# Altium schematic sheet [2]Driver1.SchDoc: Driver 1
size A4; DocumentNumber: 2; SheetNumber: 1; SheetTotal: 1
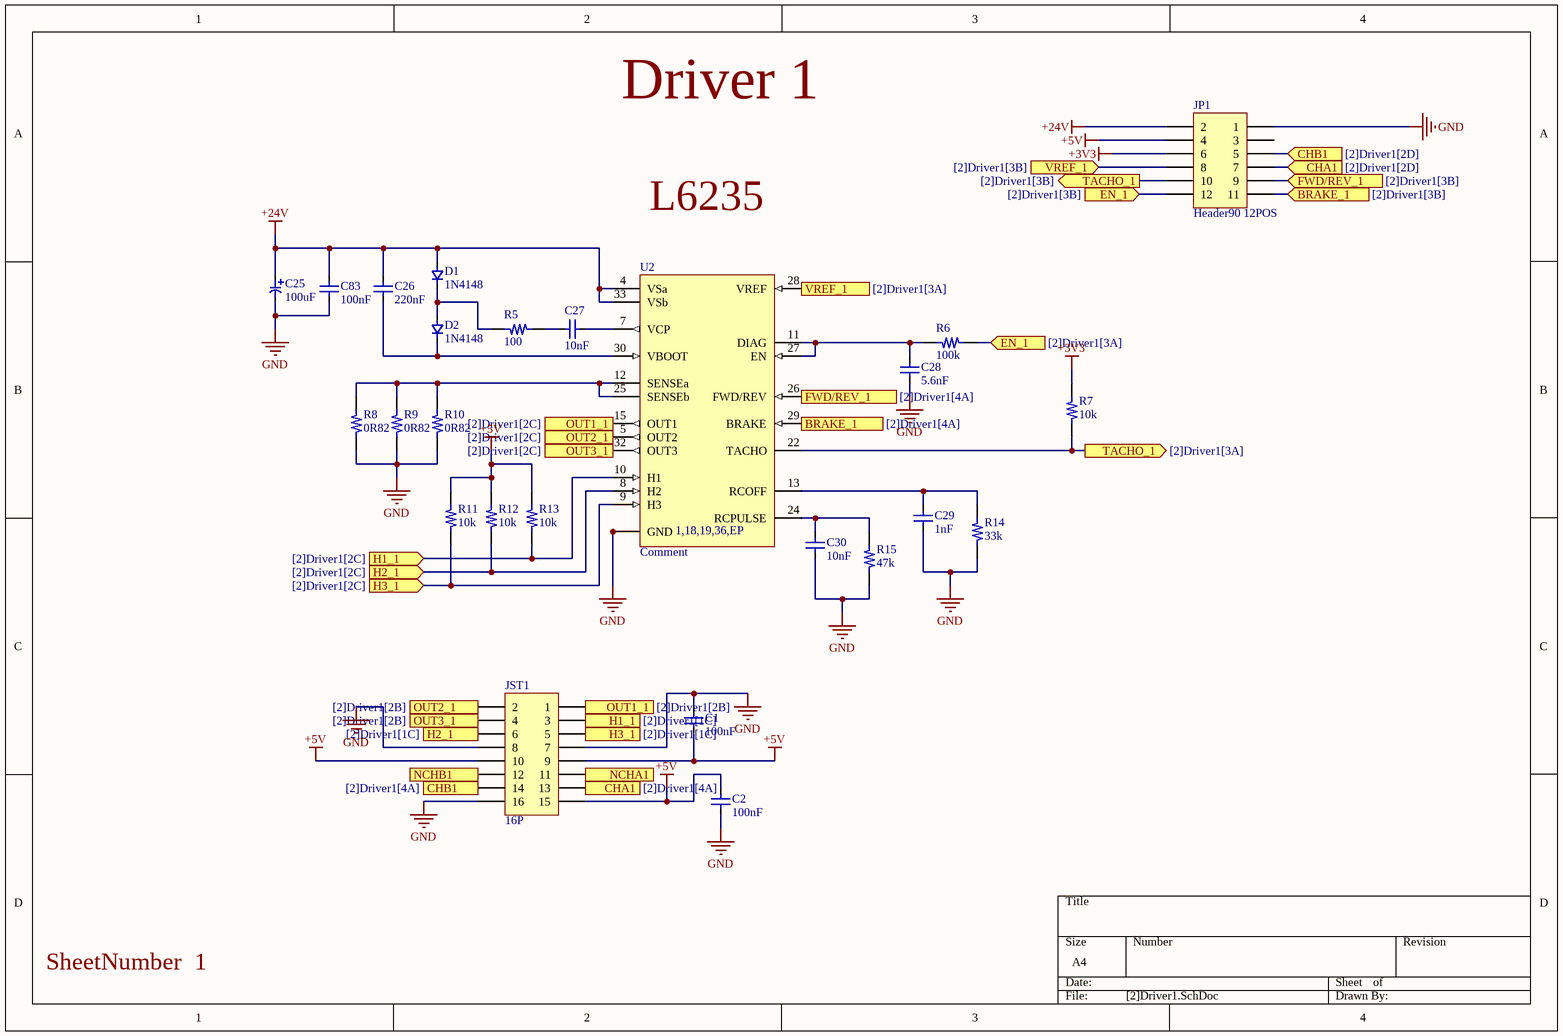
[diagram p0: [2]Driver1.SchDoc]

## Parts
C1  100nF  [C0805]
C2  100nF  [C0805]
C25  100uF  [Radial SMD 10D]
C26  220nF  [C0805]
C27  10nF  [C0805]
C28  5.6nF  [C0805]
C29  1nF  [C0805]
C30  10nF  [C0805]
C83  100nF  [C0805]
D1  1N4148  [SOD-123]
D2  1N4148  [SOD-123]
JP1  Header90 12POS  [HEADER90_06X2]
JST1  16P  [JST16P]
R5  100  [R0805]
R6  100k  [R0805]
R7  10k  [R0805]
R8  0R82  [R4122]
R9  0R82  [R4122]
R10  0R82  [R4122]
R11  10k  [R0805]
R12  10k  [R0805]
R13  10k  [R0805]
R14  33k  [R0805]
R15  47k  [R0805]
U2  Comment  [POWERSO36]

## Ports
BRAKE_1 (in, see [2]Driver1[3B]), BRAKE_1 (in, see [2]Driver1[4A]), CHA1 (in, see [2]Driver1[2D]), CHA1 (in, see [2]Driver1[4A]), CHB1 (in, see [2]Driver1[2D]), CHB1 (in, see [2]Driver1[4A]), EN_1 (in, see [2]Driver1[3A]), EN_1 (in, see [2]Driver1[3B]), FWD/REV_1 (in, see [2]Driver1[3B]), FWD/REV_1 (in, see [2]Driver1[4A]), H1_1 (in, see [2]Driver1[1C]), H1_1 (in, see [2]Driver1[2C]), H2_1 (in, see [2]Driver1[1C]), H2_1 (in, see [2]Driver1[2C]), H3_1 (in, see [2]Driver1[1C]), H3_1 (in, see [2]Driver1[2C]), NCHA1 (in), NCHB1 (in), OUT1_1 (out, see [2]Driver1[2B]), OUT1_1 (out, see [2]Driver1[2C]), OUT2_1 (out, see [2]Driver1[2B]), OUT2_1 (out, see [2]Driver1[2C]), OUT3_1 (out, see [2]Driver1[2B]), OUT3_1 (out, see [2]Driver1[2C]), TACHO_1 (out, see [2]Driver1[3A]), TACHO_1 (out, see [2]Driver1[3B]), VREF_1 (in, see [2]Driver1[3A]), VREF_1 (in, see [2]Driver1[3B])

## Nets
+3V3: JP1.6 R7.2
+5V: C1.1 C2.2 JP1.4 JST1.9 JST1.10 JST1.15 R11.1 R12.1 R13.1
+24V: C25.1 C26.2 C83.2 D1.1 JP1.2 U2.4(VSa) U2.33(VSb)
GND: C1.2 C2.1 C25.2 C28.2 C29.1 C30.1 C83.1 JP1.1 JST1.7 JST1.8 JST1.16 R8.1 R9.1 R10.1 R14.1 R15.1 U2.1(GND) U2.18(GND) U2.19(GND) U2.36(GND) U2.37(GND)
BRAKE_1: JP1.11 U2.29(BRAKE) ; port BRAKE_1
CHA1: JP1.7 JST1.13 ; port CHA1
CHB1: JP1.5 JST1.14 ; port CHB1
EN_1: JP1.12 R6.2 ; port EN_1
FWD/REV_1: JP1.9 U2.26(FWD/REV) ; port FWD/REV_1
H1_1: JST1.3 R13.2 U2.10(H1) ; port H1_1
H2_1: JST1.6 R12.2 U2.8(H2) ; port H2_1
H3_1: JST1.5 R11.2 U2.9(H3) ; port H3_1
NCHA1: JST1.11 ; port NCHA1
NCHB1: JST1.12 ; port NCHB1
OUT1_1: JST1.1 U2.15(OUT1) ; port OUT1_1
OUT2_1: JST1.2 U2.5(OUT2) ; port OUT2_1
OUT3_1: JST1.4 U2.32(OUT3) ; port OUT3_1
TACHO_1: JP1.10 R7.1 U2.22(TACHO) ; port TACHO_1
VREF_1: JP1.8 U2.28(VREF) ; port VREF_1
NetC26_1: C26.1 D2.2 U2.30(VBOOT)
NetC27_1: C27.1 R5.2
NetC27_2: C27.2 U2.7(VCP)
NetC28_1: C28.1 R6.1 U2.11(DIAG) U2.27(EN)
NetC29_2: C29.2 R14.2 U2.13(RCOFF)
NetC30_2: C30.2 R15.2 U2.24(RCPULSE)
NetD1_2: D1.2 D2.1 R5.1
NetR8_2: R8.2 R9.2 R10.2 U2.12(SENSEa) U2.25(SENSEb)

Not connected (* = marked no-connect by the designer): JP1 3

## Notes on the sheet
- L6235
- SheetNumber
- (in symbol L6235PD) 1,18,19,36,EP

## Library data of the parts
C1 C2 C83 = CC0805ZRY5V9BB104: CAP CER 0.1UF 50V Y5V 0805; Mfr 1: Yageo; Mfr 1 PN: CC0805ZRY5V9BB104
C25 = EEE1JA101P: CAP ALUM 100UF 20% 63V SMD; Mfr 1: Panasonic Electronic Components; Mfr 1 PN: EEE-1JA101P
C26 = C0805C224K5RACAUTO: CAP CER 0.22UF 50V X7R 0805; Mfr 1: KEMET; Mfr 1 PN: C0805C224K5RACAUTO
C27 C30 = CL21B103KBANFNC: CAP CER 10000PF 50V X7R 0805; Mfr 1: Samsung Electro-Mechanics; Mfr 1 PN: CL21B103KBANFNC
C28 = CL21B562KBANNNC: CAP CER 5600PF 50V X7R 0805; Mfr 1: Samsung Electro-Mechanics; Mfr 1 PN: CL21B562KBANNNC
C29 = CL21B102KBANFNC: CAP CER 1000PF 50V X7R 0805; Mfr 1: Samsung Electro-Mechanics; Mfr 1 PN: CL21B102KBANFNC
D1 D2 = 1N4148W-G RHG: DIODE GEN PURP 100V 150MA SOD123; Mfr 1: Taiwan Semiconductor Corporation; Mfr 1 PN: 1N4148W-G RHG
JP1 = 61301221021: CONN HEADER R/A 12POS 2.54MM; Mfr 1: Wurth Electronics Inc.; Mfr 1 PN: 61301221021
JST1 = S16B-PHDSS(LF)(SN): CONN HEADER PHD SIDE 16POS 2MM; Mfr 1: JST Sales America Inc.; Mfr 1 PN: S16B-PHDSS(LF)(SN)
R5 = ESR10EZPF1000: RES SMD 100 OHM 1% 0.4W 0805; Mfr 1: Rohm Semiconductor; Mfr 1 PN: ESR10EZPF1000
R6 = RC0805FR-07100KL: RES SMD 100K OHM 1% 1/8W 0805; Mfr 1: Yageo; Mfr 1 PN: RC0805FR-07100KL
R7 = CRG0805F10K/10: RES SMD 10K OHM 1% 1/8W 0805; Mfr 1: TE Connectivity Passive Product; Mfr 1 PN: CRG0805F10K/10
R8-R10 = SMW3R82JT: RES 0.82 OHM 5% 3W 4122; Mfr 1: TE Connectivity Passive Product; Mfr 1 PN: SMW3R82JT
R11-R13 = RC0805FR-0710KL: RES SMD 10K OHM 1% 1/8W 0805; Mfr 1: Yageo; Mfr 1 PN: RC0805FR-0710KL
R14 = RMCF0805FT33K0: RES 33K OHM 1% 1/8W 0805; Mfr 1: Stackpole Electronics Inc.; Mfr 1 PN: RMCF0805FT33K0
R15 = RC0805FR-0747KL: RES SMD 47K OHM 1% 1/8W 0805; Mfr 1: Yageo; Mfr 1 PN: RC0805FR-0747KL
U2 = L6235PD: IC MOTOR DRIVER PAR 36POWERSO; Mfr 1: STMicroelectronics; Mfr 1 PN: L6235PD